# Altium schematic sheet Schematic2.SchDoc
size A; SheetNumber: 2; SheetTotal: 2
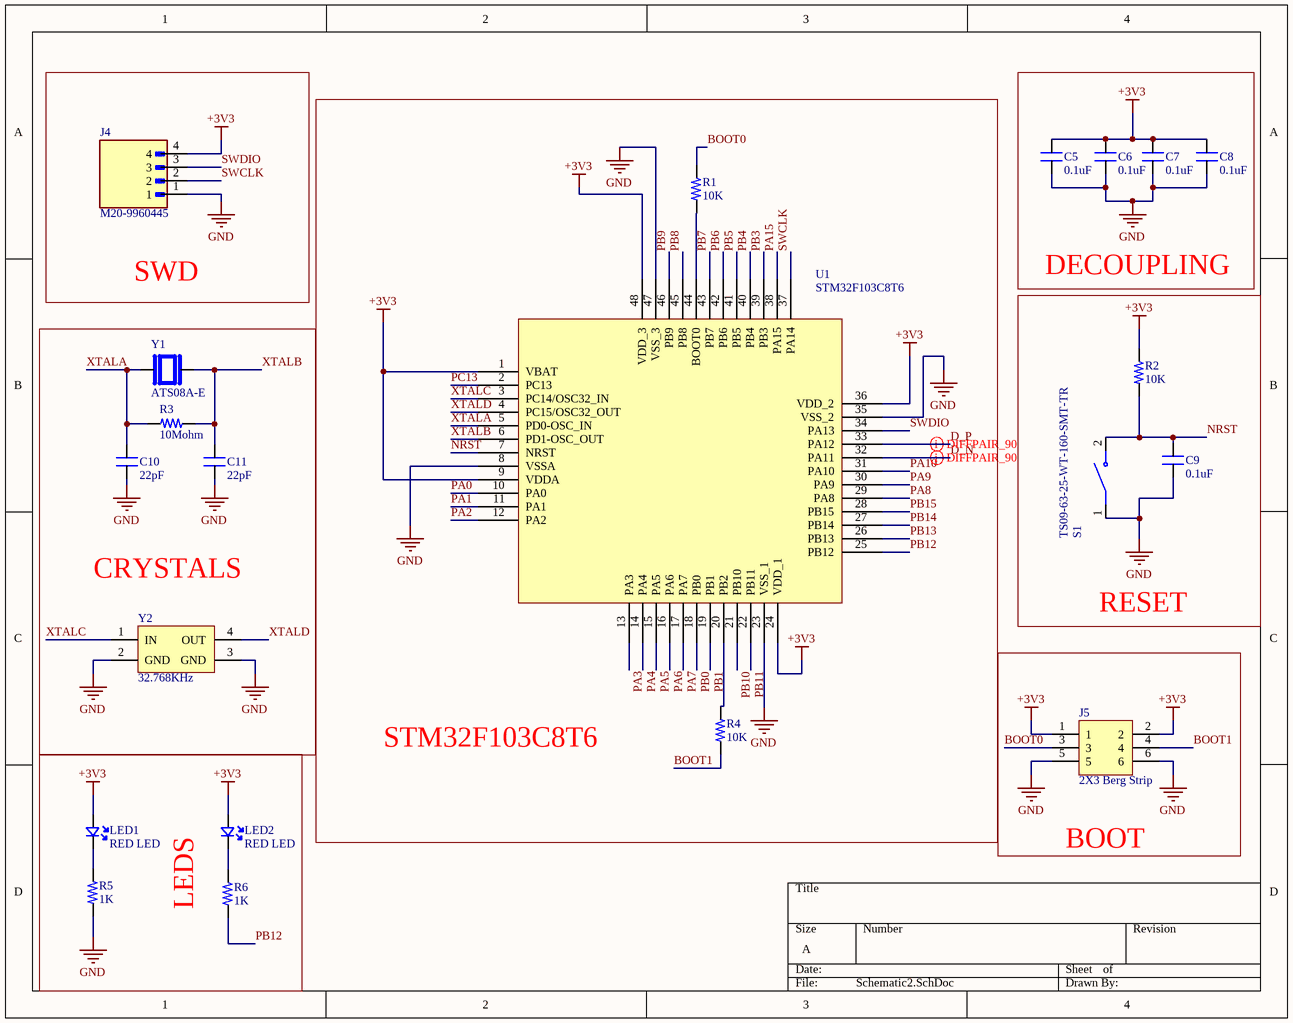
[diagram p0: Schematic2.SchDoc]

## Parts
C5  0.1uF  [CAP_0805]
C6  0.1uF  [CAP_0805]
C7  0.1uF  [CAP_0805]
C8  0.1uF  [CAP_0805]
C9  0.1uF  [CAP_0805]
C10  22pF  [CAP_0805]
C11  22pF  [CAP_0805]
J4  M20-9960445  [HARWIN_M20-9960445]
J5  2X3 Berg Strip  [CON6_100_59D78_TH_ST_Duplicate]
LED1  RED LED  [LED_0805]
LED2  RED LED  [LED_0805]
R1  10K  [RES_0805]
R2  10K  [RES_0805]
R3  10Mohm  [RES_0805]
R4  10K  [RES_0805]
R5  1K  [RES_0805]
R6  1K  [RES_0805]
S1  TS09-63-25-WT-160-SMT-TR  [SW_TS09-63-25-WT-160-SMT-TR]
U1  STM32F103C8T6  [LQFP-48_19.6_393_58X11_SMD]
Y1  ATS08A-E  [XTAL_HC49P488W43L1085T450H368]
Y2  32.768KHz  [XTAL_MC-405 32.7680K-G3]

## Blocks framed on the sheet
SWD: J4
DECOUPLING: C5-C8
STM32F103C8T6: R1 R4 U1
CRYSTALS: C10 C11 R3 Y1 Y2
RESET: C9 R2 S1
BOOT: J5
LEDS: LED1 LED2 R5 R6

## Nets
+3V3: C5.2 C6.2 C7.2 C8.2 J4.4 J5.1 J5.2 LED1.A LED2.A R2.2 U1.1(VBAT) U1.9(VDDA) U1.24(VDD_1) U1.36(VDD_2) U1.48(VDD_3)
GND: C5.1 C6.1 C7.1 C8.1 C9.1 C10.1 C11.1 J4.1 J5.5 J5.6 R5.1 S1.1 U1.8(VSSA) U1.23(VSS_1) U1.35(VSS_2) U1.47(VSS_3) Y2.2(GND) Y2.3(GND)
BOOT0: J5.3 R1.2
BOOT1: J5.4 R4.1
D_N: U1.32(PA11)
D_P: U1.33(PA12)
NRST: C9.2 R2.1 S1.2 U1.7(NRST)
PA0: U1.10(PA0)
PA1: U1.11(PA1)
PA2: U1.12(PA2)
PA3: U1.13(PA3)
PA4: U1.14(PA4)
PA5: U1.15(PA5)
PA6: U1.16(PA6)
PA7: U1.17(PA7)
PA8: U1.29(PA8)
PA9: U1.30(PA9)
PA10: U1.31(PA10)
PA15: U1.38(PA15)
PB0: U1.18(PB0)
PB1: U1.19(PB1)
PB3: U1.39(PB3)
PB4: U1.40(PB4)
PB5: U1.41(PB5)
PB6: U1.42(PB6)
PB7: U1.43(PB7)
PB8: U1.45(PB8)
PB9: U1.46(PB9)
PB10: U1.21(PB10)
PB11: U1.22(PB11)
PB12: R6.1 U1.25(PB12)
PB13: U1.26(PB13)
PB14: U1.27(PB14)
PB15: U1.28(PB15)
PC13: U1.2(PC13)
SWCLK: J4.2 U1.37(PA14)
SWDIO: J4.3 U1.34(PA13)
XTALA: C10.2 R3.1 U1.5(PD0-OSC_IN) Y1.1
XTALB: C11.2 R3.2 U1.6(PD1-OSC_OUT) Y1.2
XTALC: U1.3(PC14/OSC32_IN) Y2.1(IN)
XTALD: U1.4(PC15/OSC32_OUT) Y2.4(OUT)
NetLED1_K: LED1.K R5.2
NetLED2_K: LED2.K R6.2
NetR1_1: R1.1 U1.44(BOOT0)
NetR4_2: R4.2 U1.20(PB2)

## Layout directives
differential pair; differential pair class diff_90: D_N, D_P

## Library data of the parts
C5-C9 = CAP_0.1uF-50V-5%-0805: 0.1µF ±5% 50V Ceramic Capacitor X7R 0805 (2012 Metric); Manufacturer: KEMET; Manufacturing Part Number: C0805C104J5RACTU; Case/Package: 0805 (2012 Metric); Supplier-1: Digikey; Supplier Part Number-1: 399-1171-1-ND
C10 C11 = CAP_22pF-50V-5%-0805: 22pF ±5% 50V Ceramic Capacitor C0G, NP0 0805 (2012 Metric); Manufacturer: KEMET; Manufacturer Part Number: C0805C220J5GACTU; Case/Package: 0805; Supplier-1: Digikey; Supplier Part Number-1: 399-1113-1-ND
J4 = M20-9960445: 2.54mm (0.1) Pitch SIL Horizontal Throughboard Pin Header, 6.1mm mating pin height, gold (hi-temp mould), 4 contacts; MF: Harwin; SnapEDA_Link: https://www.snapeda.com/parts/M20-9960445/Harwin+Inc./view-part/?ref=snap; Package: None; Value: *; MP: M20-9960445; Check_prices: https://www.snapeda.com/parts/M20-9960445/Harwin+Inc./view-part/?ref=eda
J5 = CON-BS-PLG_2X3-100-TH-ST: 6 pin, 2 row, 2.54mm pitch bergstrip; Manufacturer: NA; Manufacturer Part Number: NA; Case/Package: TH; Supplier-1: NA; Supplier Part Number-1: NA
LED1 LED2 = LED-RED_10mA-0805: Red 621nm LED Indication - Discrete 2V 0805 (2012 Metric); Manufacturer: Lite-On Inc.; Manufacturer Part Number: LTST-C170EKT; Case/ Package: 0805; Supplier-1: Digikey; Supplier Part Number-1: 160-1178-1-ND
R1 R2 R4 = RES_10K-0.125W-1%-0805: 10 kOhms ±1% 0.125W, 1/8W Chip Resistor 0805 (2012 Metric) Moisture Resistant Thick Film; Manufacturer: Yageo; Manufacturing Part Number: RC0805FR-0710KL; Case/Package: 0805; Supplier-1: Digikey; Supplier Part Number-1: 311-10.0KCRCT-ND
R3 = RES_10MOHM-0.125W-1%-0805: 10 MOhms ±1% 0.125W, 1/8W Chip Resistor 0805 (2012 Metric) Automotive AEC-Q200, High Voltage Thick Film; Manufacturer: Rohm Semiconductor; Manufacturing Part Number: KTR10EZPF1005; Case/Package: 0805 (2012 Metric); Supplier-1: Digikey; Supplier Part Number-1: RHM10.0MAHCT-ND
R5 R6 = RES_1K-0.125W-1%-0805: 1 kOhms ±1% 0.125W, 1/8W Chip Resistor 0805 (2012 Metric) Moisture Resistant Thick Film; Manufacturer: 垈㎵á; Manufacturer Part Number: RC0805FR-071KL; Case/Package: 0805; Supplier-1: Digikey; Supplier Part Number-1: 311-1.00KCRCT-ND
S1 = TS09-63-25-WT-160-SMT-TR: 6.1 x 3.7 mm, 2.5 mm Actuator Height, 160 gf, White, Surface Mount, SPST, Tactile Switch; MF: Same Sky; SnapEDA_Link: https://www.snapeda.com/parts/TS09-63-25-WT-160-SMT-TR/Same+Sky/view-part/?ref=snap; Package: None; Value: *; MP: TS09-63-25-WT-160-SMT-TR; Check_prices: https://www.snapeda.com/parts/TS09-63-25-WT-160-SMT-TR/Same+Sky/view-part/?ref=eda
U1 = IC-STM32F103C8T6 _1: ARM® Cortex®-M3 STM32F1 Microcontroller IC 32-Bit 72MHz 64KB (64K x 8) FLASH; Manufacturer: STMicroelectronics; Manufacturer Part Number: STM32F103C8T6; Case/Package: 48-LQFP; Supplier-1: Digikey; Supplier Part Number-1: 497-6063-ND
Y1 = ATS08A-E: 8 MHz Â±30ppm Crystal 20pF 60 Ohms HC-49/US; MF: CTS; SnapEDA_Link: https://www.snapeda.com/parts/ATS08A-E/CTS+Components/view-part/?ref=snap; Package: HC-49/US CTS-Frequency Controls; Value: *; MP: ATS08A-E; Check_prices: https://www.snapeda.com/parts/ATS08A-E/CTS+Components/view-part/?ref=eda
Y2 = XTAL_32.768KHz-MC-405 32.7680K-G3: Crystals SMD AT XTL MHZ +/-50PPM 12.5 PF 250 T/R; Manufacturer: Epson; Manufacturing Part Number: MC-405 32.7680K-G3: ROHS; Case/Package: SMD; Supplier-1: Mouser; Supplier Part Number-1: 732-MC405327680KG3RS